# EAGLE design pam-control-module-v0 (EAGLE 8.6.3)
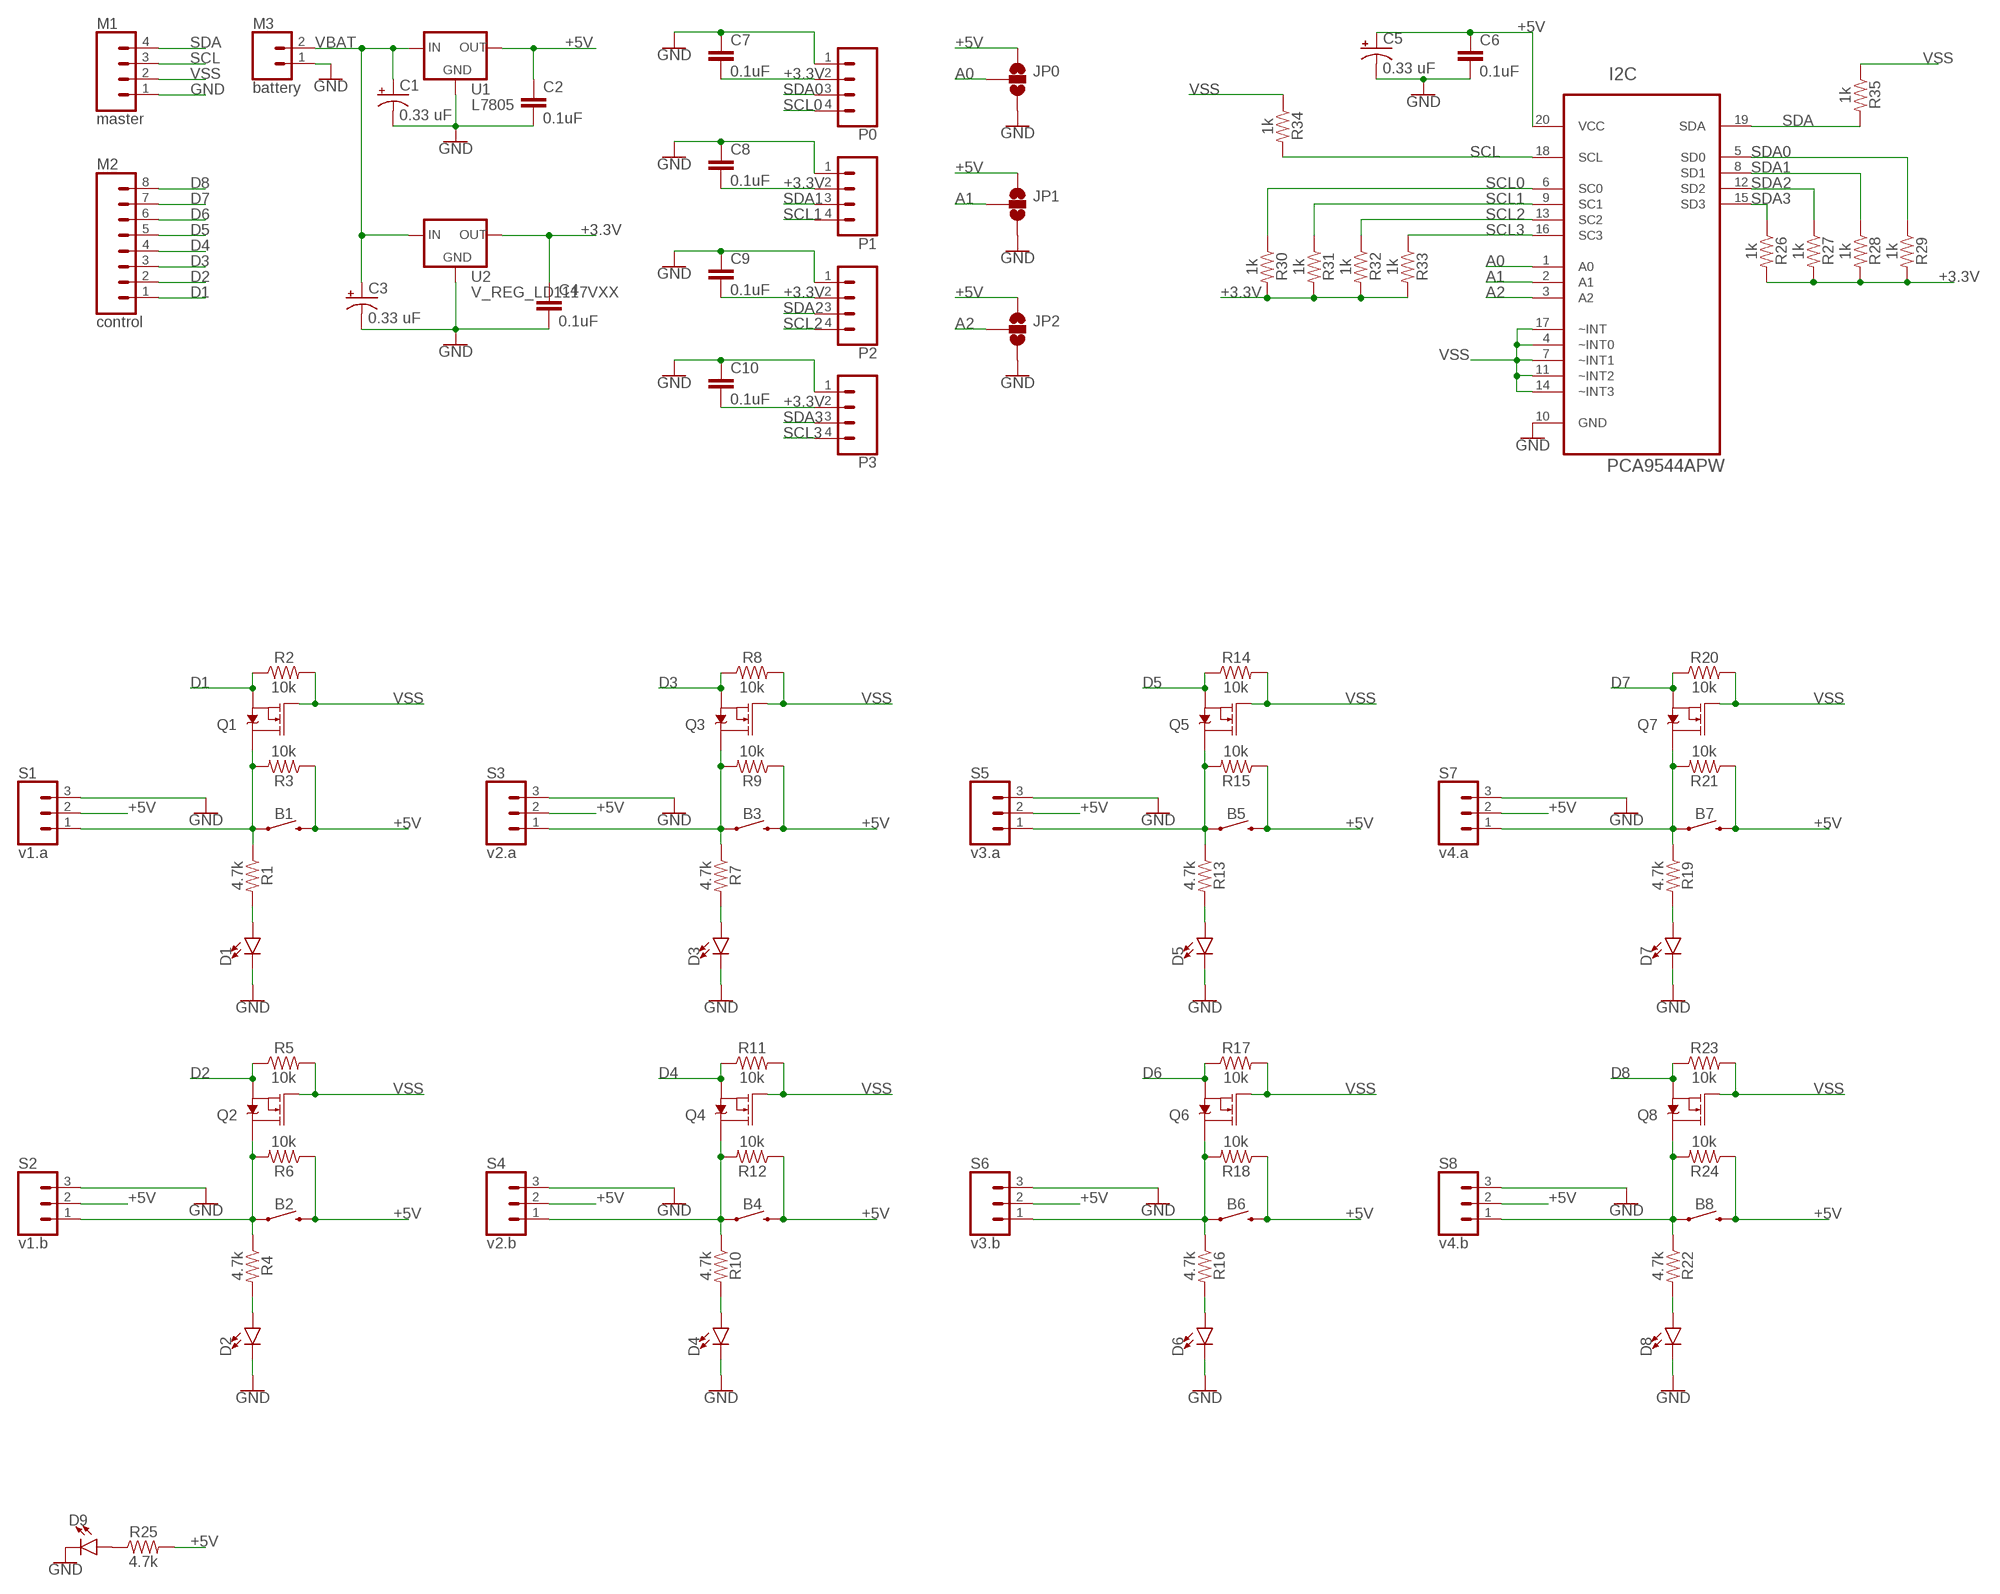
[diagram p0: schematic, sheet 1]

## Parts
B1  MOMENTARY-SWITCH-SPST-PTH-6.0MM  [TACTILE_SWITCH_PTH_6.0MM]
B2  MOMENTARY-SWITCH-SPST-PTH-6.0MM  [TACTILE_SWITCH_PTH_6.0MM]
B3  MOMENTARY-SWITCH-SPST-PTH-6.0MM  [TACTILE_SWITCH_PTH_6.0MM]
B4  MOMENTARY-SWITCH-SPST-PTH-6.0MM  [TACTILE_SWITCH_PTH_6.0MM]
B5  MOMENTARY-SWITCH-SPST-PTH-6.0MM  [TACTILE_SWITCH_PTH_6.0MM]
B6  MOMENTARY-SWITCH-SPST-PTH-6.0MM  [TACTILE_SWITCH_PTH_6.0MM]
B7  MOMENTARY-SWITCH-SPST-PTH-6.0MM  [TACTILE_SWITCH_PTH_6.0MM]
B8  MOMENTARY-SWITCH-SPST-PTH-6.0MM  [TACTILE_SWITCH_PTH_6.0MM]
C1  0.33 uF  CPOL-USE2-5  [E2-5]
C2  0.1uF  0.1UF-KIT-EZ-50V-20%  [CAP-PTH-SMALL-KIT]
C3  0.33 uF  CPOL-USE2-5  [E2-5]
C4  0.1uF  0.1UF-KIT-EZ-50V-20%  [CAP-PTH-SMALL-KIT]
C5  0.33 uF  CPOL-USE2-5  [E2-5]
C6  0.1uF  0.1UF-KIT-EZ-50V-20%  [CAP-PTH-SMALL-KIT]
C7  0.1uF  0.1UF-KIT-EZ-50V-20%  [CAP-PTH-SMALL-KIT]
C8  0.1uF  0.1UF-KIT-EZ-50V-20%  [CAP-PTH-SMALL-KIT]
C9  0.1uF  0.1UF-KIT-EZ-50V-20%  [CAP-PTH-SMALL-KIT]
C10  0.1uF  0.1UF-KIT-EZ-50V-20%  [CAP-PTH-SMALL-KIT]
D1  LED3MM  [LED_3MM]
D2  LED3MM  [LED_3MM]
D3  LED3MM  [LED_3MM]
D4  LED3MM  [LED_3MM]
D5  LED3MM  [LED_3MM]
D6  LED3MM  [LED_3MM]
D7  LED3MM  [LED_3MM]
D8  LED3MM  [LED_3MM]
D9  LED3MM  [LED_3MM]
I2C  PCA9544APW  [SOP65P640X120-20N]
JP0  JUMPER-SMT_3_NO_SILK  [SMT-JUMPER_3_NO_SILK]
JP1  JUMPER-SMT_3_NO_SILK  [SMT-JUMPER_3_NO_SILK]
JP2  JUMPER-SMT_3_NO_SILK  [SMT-JUMPER_3_NO_SILK]
M1  master  CONN_04  [1X04]
M2  control  CONN_08"  [1X08]
M3  battery  CONN_02  [1X02]
P0  CONN_04  [1X04]
P1  CONN_04  [1X04]
P2  CONN_04  [1X04]
P3  CONN_04  [1X04]
Q1  MOSFET-NCH-BSS138  [SOT23-3]
Q2  MOSFET-NCH-BSS138  [SOT23-3]
Q3  MOSFET-NCH-BSS138  [SOT23-3]
Q4  MOSFET-NCH-BSS138  [SOT23-3]
Q5  MOSFET-NCH-BSS138  [SOT23-3]
Q6  MOSFET-NCH-BSS138  [SOT23-3]
Q7  MOSFET-NCH-BSS138  [SOT23-3]
Q8  MOSFET-NCH-BSS138  [SOT23-3]
R1  4.7k  1KOHM-HORIZ-1/4W-1%  [AXIAL-0.3]
R2  10k  1KOHM-HORIZ-1/4W-1%  [AXIAL-0.3]
R3  10k  1KOHM-HORIZ-1/4W-1%  [AXIAL-0.3]
R4  4.7k  1KOHM-HORIZ-1/4W-1%  [AXIAL-0.3]
R5  10k  1KOHM-HORIZ-1/4W-1%  [AXIAL-0.3]
R6  10k  1KOHM-HORIZ-1/4W-1%  [AXIAL-0.3]
R7  4.7k  1KOHM-HORIZ-1/4W-1%  [AXIAL-0.3]
R8  10k  1KOHM-HORIZ-1/4W-1%  [AXIAL-0.3]
R9  10k  1KOHM-HORIZ-1/4W-1%  [AXIAL-0.3]
R10  4.7k  1KOHM-HORIZ-1/4W-1%  [AXIAL-0.3]
R11  10k  1KOHM-HORIZ-1/4W-1%  [AXIAL-0.3]
R12  10k  1KOHM-HORIZ-1/4W-1%  [AXIAL-0.3]
R13  4.7k  1KOHM-HORIZ-1/4W-1%  [AXIAL-0.3]
R14  10k  1KOHM-HORIZ-1/4W-1%  [AXIAL-0.3]
R15  10k  1KOHM-HORIZ-1/4W-1%  [AXIAL-0.3]
R16  4.7k  1KOHM-HORIZ-1/4W-1%  [AXIAL-0.3]
R17  10k  1KOHM-HORIZ-1/4W-1%  [AXIAL-0.3]
R18  10k  1KOHM-HORIZ-1/4W-1%  [AXIAL-0.3]
R19  4.7k  1KOHM-HORIZ-1/4W-1%  [AXIAL-0.3]
R20  10k  1KOHM-HORIZ-1/4W-1%  [AXIAL-0.3]
R21  10k  1KOHM-HORIZ-1/4W-1%  [AXIAL-0.3]
R22  4.7k  1KOHM-HORIZ-1/4W-1%  [AXIAL-0.3]
R23  10k  1KOHM-HORIZ-1/4W-1%  [AXIAL-0.3]
R24  10k  1KOHM-HORIZ-1/4W-1%  [AXIAL-0.3]
R25  4.7k  1KOHM-HORIZ-1/4W-1%  [AXIAL-0.3]
R26  1k  1KOHM-HORIZ-1/4W-1%  [AXIAL-0.3]
R27  1k  1KOHM-HORIZ-1/4W-1%  [AXIAL-0.3]
R28  1k  1KOHM-HORIZ-1/4W-1%  [AXIAL-0.3]
R29  1k  1KOHM-HORIZ-1/4W-1%  [AXIAL-0.3]
R30  1k  1KOHM-HORIZ-1/4W-1%  [AXIAL-0.3]
R31  1k  1KOHM-HORIZ-1/4W-1%  [AXIAL-0.3]
R32  1k  1KOHM-HORIZ-1/4W-1%  [AXIAL-0.3]
R33  1k  1KOHM-HORIZ-1/4W-1%  [AXIAL-0.3]
R34  1k  1KOHM-HORIZ-1/4W-1%  [AXIAL-0.3]
R35  1k  1KOHM-HORIZ-1/4W-1%  [AXIAL-0.3]
S1  v1.a  CONN_03  [1X03]
S2  v1.b  CONN_03  [1X03]
S3  v2.a  CONN_03  [1X03]
S4  v2.b  CONN_03  [1X03]
S5  v3.a  CONN_03  [1X03]
S6  v3.b  CONN_03  [1X03]
S7  v4.a  CONN_03  [1X03]
S8  v4.b  CONN_03  [1X03]
U1  L7805  V_REG_78XXSIDE  [78XXL]
U2  V_REG_LD1117VXX  [78XXL]

## Nets
+3.3V: C4.1 C7.2 C8.2 C9.2 C10.2 P0.2 P1.2 P2.2 P3.2 R26.P$2 R27.P$2 R28.P$2 R29.P$2 R30.P$2 R31.P$2 R32.P$2 R33.P$2 U2.GND(OUT)
+5V: B1.3 B2.3 B3.3 B4.3 B5.3 B6.3 B7.3 B8.3 C2.1 C5.+ C6.1 I2C.20(VCC) JP0.1 JP1.1 JP2.1 R3.P$1 R6.P$1 R9.P$1 R12.P$1 R15.P$1 R18.P$1 R21.P$1 R24.P$1 R25.P$2 S1.2 S2.2 S3.2 S4.2 S5.2 S6.2 S7.2 S8.2 U1.OUT
A0: I2C.1(A0) JP0.2
A1: I2C.2(A1) JP1.2
A2: I2C.3(A2) JP2.2
D1: M2.1 Q1.2(S) R2.P$1
D2: M2.2 Q2.2(S) R5.P$1
D3: M2.3 Q3.2(S) R8.P$1
D4: M2.4 Q4.2(S) R11.P$1
D5: M2.5 Q5.2(S) R14.P$1
D6: M2.6 Q6.2(S) R17.P$1
D7: M2.7 Q7.2(S) R20.P$1
D8: M2.8 Q8.2(S) R23.P$1
GND: C1.- C2.2 C3.- C4.2 C5.- C6.2 C7.1 C8.1 C9.1 C10.1 D1.K(C) D2.K(C) D3.K(C) D4.K(C) D5.K(C) D6.K(C) D7.K(C) D8.K(C) D9.K(C) I2C.10(GND) JP0.3 JP1.3 JP2.3 M1.1 M3.1 P0.1 P1.1 P2.1 P3.1 S1.3 S2.3 S3.3 S4.3 S5.3 S6.3 S7.3 S8.3 U1.GND U2.IN(GND)
N$1: D1.A R1.P$2
N$2: D2.A R4.P$2
N$3: D3.A R7.P$2
N$4: D4.A R10.P$2
N$5: B2.1 Q2.3(D) R4.P$1 R6.P$2 S2.1
N$6: D5.A R13.P$2
N$7: D6.A R16.P$2
N$8: D7.A R19.P$2
N$9: D8.A R22.P$2
N$10: D9.A R25.P$1
N$11: B4.1 Q4.3(D) R10.P$1 R12.P$2 S4.1
N$12: B6.1 Q6.3(D) R16.P$1 R18.P$2 S6.1
N$13: B8.1 Q8.3(D) R22.P$1 R24.P$2 S8.1
N$14: B7.1 Q7.3(D) R19.P$1 R21.P$2 S7.1
N$15: B5.1 Q5.3(D) R13.P$1 R15.P$2 S5.1
N$16: B3.1 Q3.3(D) R7.P$1 R9.P$2 S3.1
N$17: B1.1 Q1.3(D) R1.P$1 R3.P$2 S1.1
SCL: I2C.18(SCL) M1.3 R34.P$2
SCL0: I2C.6(SC0) P0.4 R30.P$1
SCL1: I2C.9(SC1) P1.4 R31.P$1
SCL2: I2C.13(SC2) P2.4 R32.P$1
SCL3: I2C.16(SC3) P3.4 R33.P$1
SDA: I2C.19(SDA) M1.4 R35.P$2
SDA0: I2C.5(SD0) P0.3 R29.P$1
SDA1: I2C.8(SD1) P1.3 R28.P$1
SDA2: I2C.12(SD2) P2.3 R27.P$1
SDA3: I2C.15(SD3) P3.3 R26.P$1
VBAT: C1.+ C3.+ M3.2 U1.IN U2.OUT(IN)
VSS: I2C.4(~INT0) I2C.7(~INT1) I2C.11(~INT2) I2C.14(~INT3) I2C.17(~INT) M1.2 Q1.1(G) Q2.1(G) Q3.1(G) Q4.1(G) Q5.1(G) Q6.1(G) Q7.1(G) Q8.1(G) R2.P$2 R5.P$2 R8.P$2 R11.P$2 R14.P$2 R17.P$2 R20.P$2 R23.P$2 R34.P$1 R35.P$1

## Library data of the parts
B1-B8 = SparkFun-Switches:MOMENTARY-SWITCH-SPST: Momentary Switch (Pushbutton) - SPST Normally-open (NO) SPST momentary switches (buttons, pushbuttons). Variants PTH-12MM - 12mm square, through-hole Momentary Pushbutton Switch - 12mm Square <https://www.sparkfun.com/products/9190> (COM-09190) PTH-6.0MM, PTH-6.0MM-KIT - 6.0mm square, through-hole Mini Pushbutton Switch <https://www.sparkfun.com/products/97> (COM-00097) KIT package intended for soldering kit's - only one side of pads' copper is exposed. PTH-RIGHT-ANGLE-KIT - Right-angle, through-hole Right Angle Tactile Button <https://www.sparkfun.com/products/10791> - Used on SparkFun BigTime Watch Kit <https://www.sparkfun.com/products/11734> SMD-12MM - 12mm square, surface-mount Tactile Button - SMD (12mm) <https://www.sparkfun.com/products/12993> (COM-12993) Used on SparkFun PicoBoard <https://www.sparkfun.com/products/11888> SMD-4.5MM - 4.5mm Square Trackball Switch Used on SparkFun Blackberry Trackballer Breakout <https://www.sparkfun.com/products/13169> SMD-4.6MMX2.8MM - 4.60mm x 2.80mm, surface mount Used on SparkFun SAMD21 Mini Breakout <https://www.sparkfun.com/products/13664> SMD-5.2MM, SMD-5.2-REDUNDANT - 5.2mm square, surface-mount Mini Pushbutton Switch - SMD <https://www.sparkfun.com/products/8720> (COM-08720) Used on Arduino Pro Mini <https://www.sparkfun.com/products/11114> REDUNDANT package connects both switch circuits together SMD-6.0X3.5MM - 6.0 x 3.5mm, surface mount Momentary Reset Switch SMD <https://www.sparkfun.com/products/8229> (COM-08229) SMD-6.2MM-TALL - 6.2mm square, surface mount Tactile Button - SMD (6mm) <https://www.sparkfun.com/products/12992> Used on SparkFun Digital Sandbox <https://www.sparkfun.com/products/12651> SMD-RIGHT-ANGLE - Right-angle, surface mount Used on SparkFun Block for Intel® Edison - Arduino <https://www.sparkfun.com/products/13036>; PROD_ID: SWCH-08441; SF_SKU: COM-00097
C1 C3 C5 = adafruit:CPOL-US: POLARIZED CAPACITOR, American symbol
C2 C4 C6-C10 = SparkFun-Capacitors:0.1UF: 0.1µF ceramic capacitors A capacitor is a passive two-terminal electrical component used to store electrical energy temporarily in an electric field.; PROD_ID: CAP-08370
D1-D9 = SparkFun-LED:LED: LED (Generic) Standard schematic elements and footprints for 5mm, 3mm, 1206, and 0603 sized LEDs. Generic LEDs with no color specified.; PROD_ID: DIO-08794
I2C = PCA9544APW:PCA9544APW: 4-CHANNEL I2C AND SMBus MULTIPLEXER WITH INTERRUPT LOGIC; AVAILABILITY: Unavailable; DESCRIPTION: 4-Channel I2C And SMBus Multiplexer With Interrupt Logic 20-TSSOP -40 to 85; MF: Texas Instruments; MP: PCA9544APW; PACKAGE: TSSOP-20 Texas Instruments; PRICE: None
JP0 JP1 JP2 = SparkFun-Jumpers:JUMPER-SMT_3_NO: Normally open jumper This jumper has three pads in close proximity to each other. Apply solder to close the connection(s).
M1 P0 P1-P3 = SparkFun-Connectors:CONN_04: Multi connection point. Often used as Generic Header-pin footprint for 0.1 inch spaced/style header connections On any of the 0.1 inch spaced packages, you can populate with these: Break Away Headers - Straight <https://www.sparkfun.com/products/116> (PRT-00116) Break Away Male Headers - Right Angle <https://www.sparkfun.com/products/553> (PRT-00553) Female Headers <https://www.sparkfun.com/products/115> (PRT-00115) Break Away Headers - Machine Pin <https://www.sparkfun.com/products/117> (PRT-00117) Break Away Female Headers - Swiss Machine Pin <https://www.sparkfun.com/products/743> (PRT-00743) For SCREWTERMINALS and SPRING TERMINALS visit here: Screw Terimnals on SparkFun.com <https://www.sparkfun.com/search/results?term=Screw+Terminals> (5mm/3.5mm/2.54mm spacing) This device is also useful as a general connection point to wire up your design to another part of your project. Our various solder wires solder well into these plated through hole pads. Hook-Up Wire - Assortment (Stranded, 22 AWG) <https://www.sparkfun.com/products/11375> (PRT-11375) Hook-Up Wire - Assortment (Solid Core, 22 AWG) <https://www.sparkfun.com/products/11367> (PRT-11367) View the entire wire category on our website here <https://www.sparkfun.com/categories/141> Special notes: Molex polarized connector foot print use with SKU : PRT-08231 with associated crimp pins and housings. 1MM SMD Version SKU: PRT-10208; PROD_ID: CONN-09696
M2 = SparkFun-Connectors:CONN_08: Multi connection point. Often used as Generic Header-pin footprint for 0.1 inch spaced/style header connections On any of the 0.1 inch spaced packages, you can populate with these: Break Away Headers - Straight <https://www.sparkfun.com/products/116> (PRT-00116) Break Away Male Headers - Right Angle <https://www.sparkfun.com/products/553> (PRT-00553) Female Headers <https://www.sparkfun.com/products/115> (PRT-00115) Break Away Headers - Machine Pin <https://www.sparkfun.com/products/117> (PRT-00117) Break Away Female Headers - Swiss Machine Pin <https://www.sparkfun.com/products/743> (PRT-00743) Arduino Stackable Header - 8 Pin <https://www.sparkfun.com/products/9279> (PRT-09279) For SCREWTERMINALS and SPRING TERMINALS visit here: Screw Terimnals on SparkFun.com <https://www.sparkfun.com/search/results?term=Screw+Terminals> (5mm/3.5mm/2.54mm spacing) This device is also useful as a general connection point to wire up your design to another part of your project. Our various solder wires solder well into these plated through hole pads. Hook-Up Wire - Assortment (Stranded, 22 AWG) <https://www.sparkfun.com/products/11375> (PRT-11375) Hook-Up Wire - Assortment (Solid Core, 22 AWG) <https://www.sparkfun.com/products/11367> (PRT-11367) View the entire wire category on our website here <https://www.sparkfun.com/categories/141> Special notes: Molex polarized connector foot print use with SKU : PRT-08231 with associated crimp pins and housings. 1MM SMD Version SKU: PRT-10208 NOTES ON THE VARIANTS LOCK and LOCK_LONGPADS... This footprint was designed to help hold the alignment of a through-hole component (i.e. 6-pin header) while soldering it into place. You may notice that each hole has been shifted either up or down by 0.005 of an inch from it's more standard position (which is a perfectly straight line). This slight alteration caused the pins (the squares in the middle) to touch the edges of the holes. Because they are alternating, it causes a "brace" to hold the component in place. 0.005 has proven to be the perfect amount of "off-center" position when using our standard breakaway headers. Although looks a little odd when you look at the bare footprint, once you have a header in there, the alteration is very hard to notice. Also,if you push a header all the way into place, it is covered up entirely on the bottom side.; PROD_ID: CONN-08438
M3 = SparkFun-Connectors:CONN_02: Multi connection point. Often used as Generic Header-pin footprint for 0.1 inch spaced/style header connections On any of the 0.1 inch spaced packages, you can populate with these: Break Away Headers - Straight <https://www.sparkfun.com/products/116> (PRT-00116) Break Away Male Headers - Right Angle <https://www.sparkfun.com/products/553> (PRT-00553) Female Headers <https://www.sparkfun.com/products/115> (PRT-00115) Break Away Headers - Machine Pin <https://www.sparkfun.com/products/117> (PRT-00117) Break Away Female Headers - Swiss Machine Pin <https://www.sparkfun.com/products/743> (PRT-00743) For SCREWTERMINALS and SPRING TERMINALS visit here: Screw Terimnals on SparkFun.com <https://www.sparkfun.com/search/results?term=Screw+Terminals> (5mm/3.5mm/2.54mm spacing) This device is also useful as a general connection point to wire up your design to another part of your project. Our various solder wires solder well into these plated through hole pads. Hook-Up Wire - Assortment (Stranded, 22 AWG) <https://www.sparkfun.com/products/11375> (PRT-11375) Hook-Up Wire - Assortment (Solid Core, 22 AWG) <https://www.sparkfun.com/products/11367> (PRT-11367) View the entire wire category on our website here <https://www.sparkfun.com/categories/141> Special notes: Molex polarized connector foot print use with: PRT-08233 with associated crimp pins and housings. 2.54_SCREWTERM for use with PRT-10571. 3.5mm Screw Terminal footprints for PRT-08084 5mm Screw Terminal footprints for use with PRT-08432
Q1-Q8 = SparkFun-DiscreteSemi:MOSFET-NCH: N-channel MOSFETs Voltage controlled devices that allow control of high current outputs. SparkFun Products: SparkFun OpenScale <https://www.sparkfun.com/products/13261> SparkFun Digital Sandbox <https://www.sparkfun.com/products/12651> SparkFun Monster Moto Shield <https://www.sparkfun.com/products/10182> SparkFun MOSFET Power Controller <https://www.sparkfun.com/products/11214>; PROD_ID: TRANS-00830; VALUE: 220mA/50V/3.5Ω
R1-R25 = SparkFun-Resistors:1KOHM: 1kΩ resistor A resistor is a passive two-terminal electrical component that implements electrical resistance as a circuit element. Resistors act to reduce current flow, and, at the same time, act to lower voltage levels within circuits. - Wikipedia; PROD_ID: RES-12182; VALUE: 1k
R26-R35 = SparkFun-Resistors:1KOHM: 1kΩ resistor A resistor is a passive two-terminal electrical component that implements electrical resistance as a circuit element. Resistors act to reduce current flow, and, at the same time, act to lower voltage levels within circuits. - Wikipedia; PROD_ID: RES-12182
S1-S8 = SparkFun-Connectors:CONN_03: Multi connection point. Often used as Generic Header-pin footprint for 0.1 inch spaced/style header connections On any of the 0.1 inch spaced packages, you can populate with these: Break Away Headers - Straight <https://www.sparkfun.com/products/116> (PRT-00116) Break Away Male Headers - Right Angle <https://www.sparkfun.com/products/553> (PRT-00553) Female Headers <https://www.sparkfun.com/products/115> (PRT-00115) Break Away Headers - Machine Pin <https://www.sparkfun.com/products/117> (PRT-00117) Break Away Female Headers - Swiss Machine Pin <https://www.sparkfun.com/products/743> (PRT-00743) Stackable Header - 3 Pin (Female, 0.1") <https://www.sparkfun.com/products/13875> (PRT-13875) For SCREWTERMINALS and SPRING TERMINALS visit here: Screw Terimnals on SparkFun.com <https://www.sparkfun.com/search/results?term=Screw+Terminals> (5mm/3.5mm/2.54mm spacing) This device is also useful as a general connection point to wire up your design to another part of your project. Our various solder wires solder well into these plated through hole pads. Hook-Up Wire - Assortment (Stranded, 22 AWG) <https://www.sparkfun.com/products/11375> (PRT-11375) Hook-Up Wire - Assortment (Solid Core, 22 AWG) <https://www.sparkfun.com/products/11367> (PRT-11367) View the entire wire category on our website here <https://www.sparkfun.com/categories/141> Special notes: Molex polarized connector foot print use with SKU : PRT-08232 with associated crimp pins and housings.
U1 = SparkFun-IC-Power:V_REG_78XX: Voltage Regulator Standard 78xx regulator. IGO (Input Ground Output). Spark Fun Electronics SKU : COM-00107
U2 = SparkFun-IC-Power:V_REG_LD1117VXX: LD1117VXX voltage regulator. We carry the 3.3V version (COM-00526) in TO-220 package.

## Board
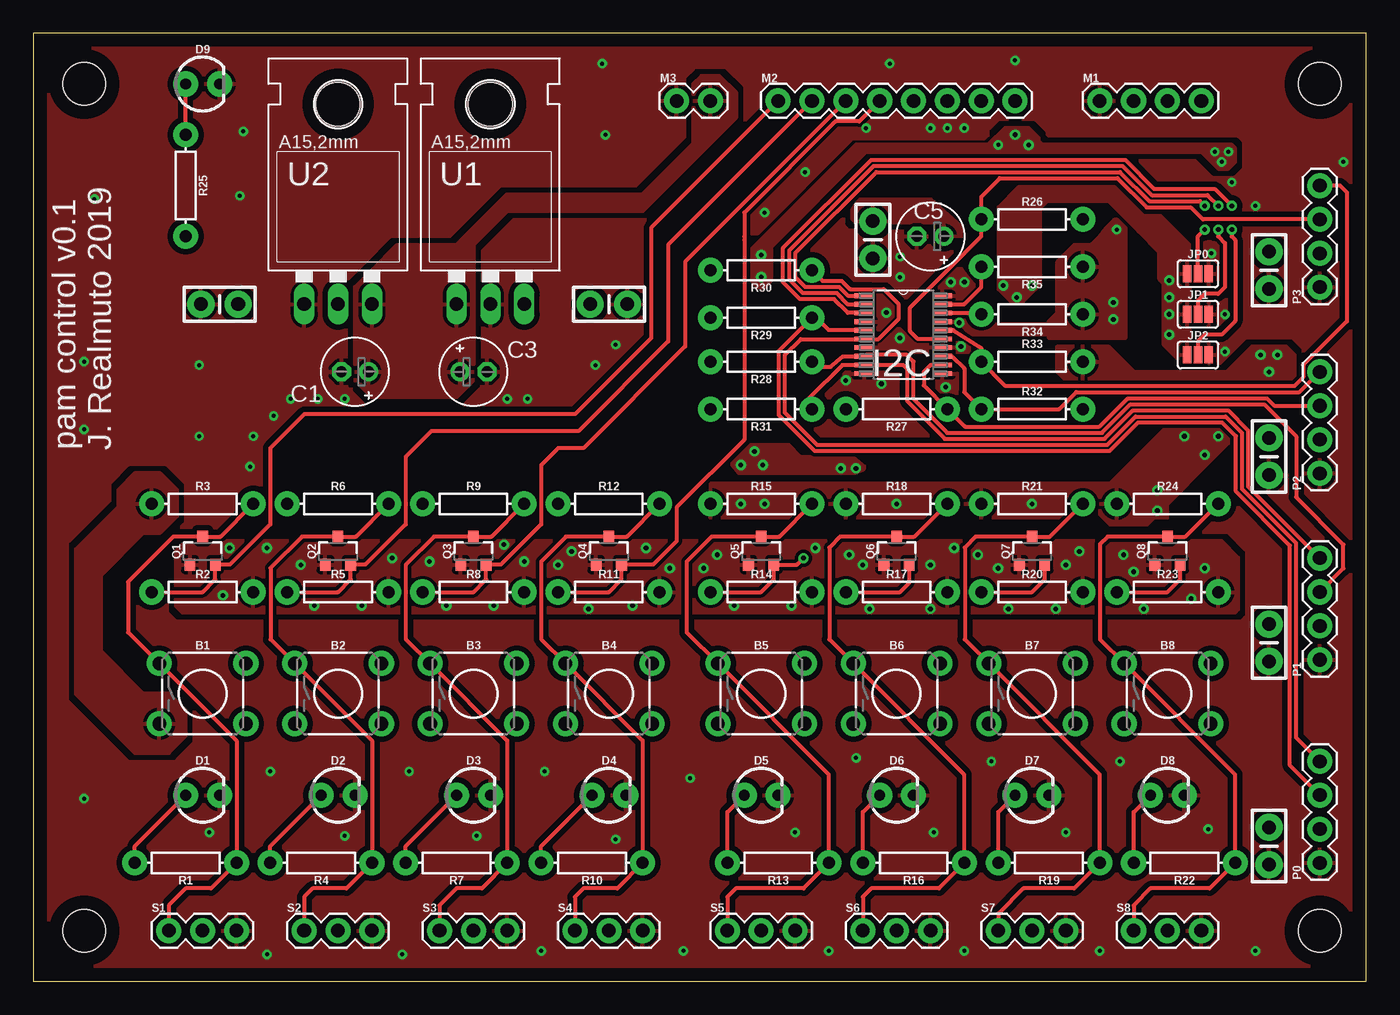
[diagram p1: board, top side]
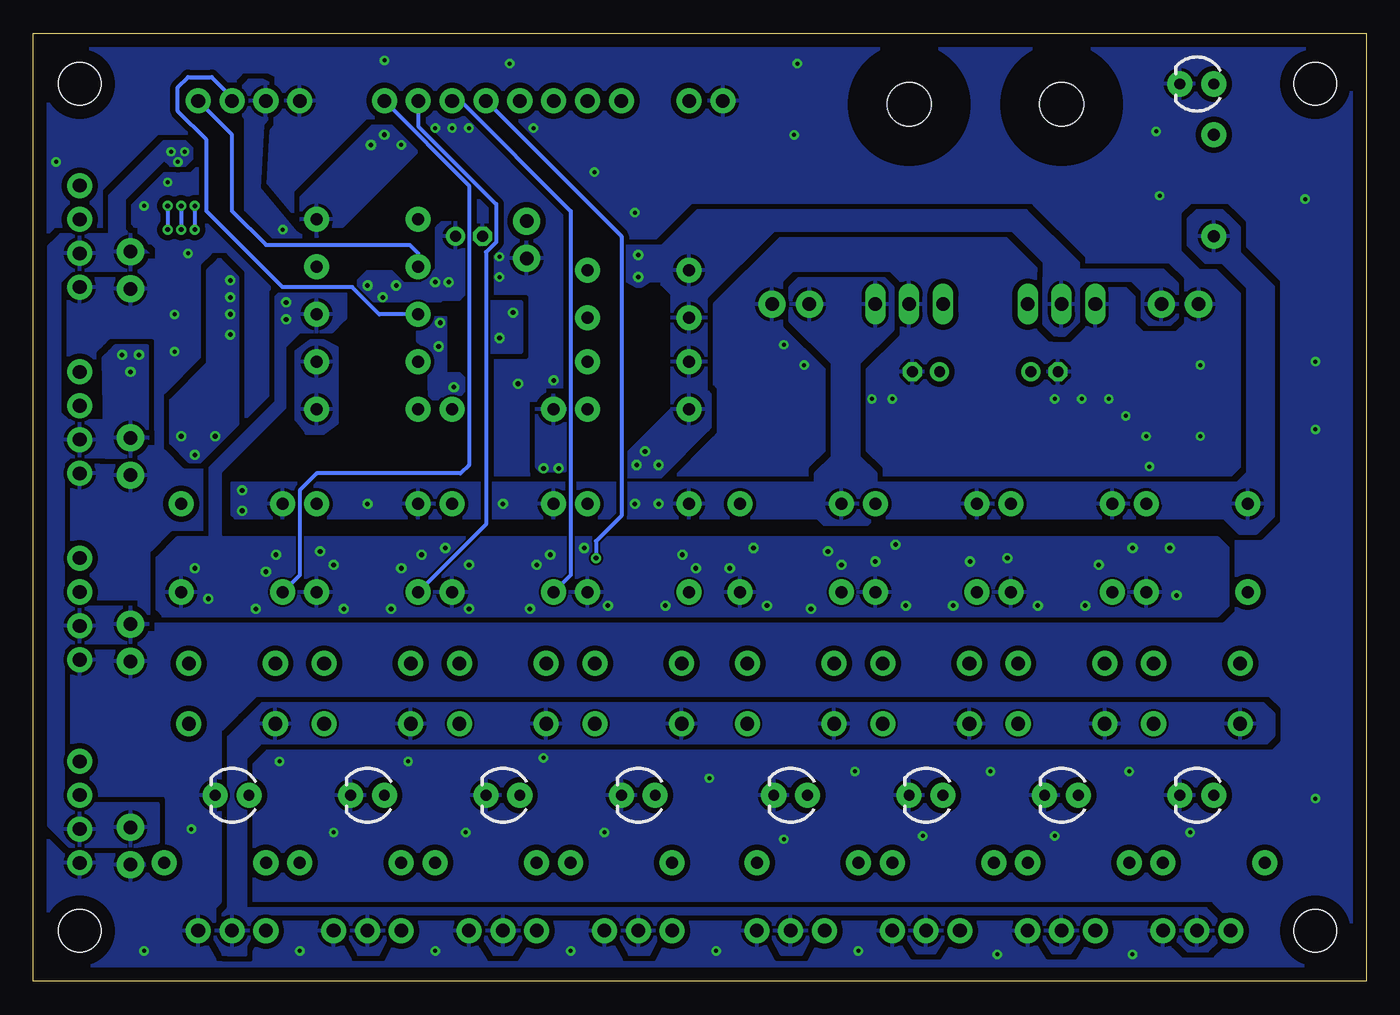
[diagram p2: board, bottom side, seen from below]

Size 100 x 71.11 mm. Coordinates in mm from the lower left corner, seen from the top.
Outline: 0,0 100,0 100,71.11 0,71.11 0,0
Copper layers (1*16): Top 0.035mm / dielectric 1.5mm / Bottom 0.035mm
Design rules "default *": minimum track width 6mil, minimum drill 0.3mm, track to track 6mil, track to pad 6mil, pad to pad 6mil, via to via 6mil, smd to smd 6mil, copper to edge 40mil, drill to drill 6mil, minimum pad ring 10mil, minimum via ring 8mil, stop-mask expansion 4mil, vias tented up to drill 0mil, thermal gap 10mil
Holes 3.2 mm at 3.81,3.81 3.81,67.31 96.52,3.81 96.52,67.31

### Footprints (pad centres in the part's own frame; a part is rotated, then mirrored left to right if it is on the bottom)
TACTILE_SWITCH_PTH_6.0MM = drill 1.016 pad 1.88: 1 -3.251,2.261; 2 3.251,2.261; 3 -3.251,-2.261; 4 3.251,-2.261
E2-5 = drill 0.813 pad 1.422: + -1.016,0 | drill 0.813 pad 1.422 octagon: - 1.016,0
CAP-PTH-SMALL-KIT = drill 1.016 pad 2.032: 1 -1.397,0; 2 1.397,0
LED_3MM = drill 0.813 pad 1.88: A -1.27,0; K 1.27,0
SOP65P640X120-20N = smd 1.473 x 0.356: 1 -2.921,2.921; 2 -2.921,2.286; 3 -2.921,1.626; 4 -2.921,0.965; 5 -2.921,0.33; 6 -2.921,-0.33; 7 -2.921,-0.965; 8 -2.921,-1.626; 9 -2.921,-2.286; 10 -2.921,-2.921; 11 2.921,-2.921; 12 2.921,-2.286; 13 2.921,-1.626; 14 2.921,-0.965; 15 2.921,-0.33; 16 2.921,0.33; 17 2.921,0.965; 18 2.921,1.626; 19 2.921,2.286; 20 2.921,2.921
SMT-JUMPER_3_NO_SILK = smd 0.635 x 1.27: 1 -0.813,0; 2 0,0; 3 0.813,0
1X04 = drill 1.016 pad 1.88: 1 0,0; 2 2.54,0; 3 5.08,0; 4 7.62,0
1X08 = drill 1.016 pad 1.88: 1 0,0; 2 2.54,0; 3 5.08,0; 4 7.62,0; 5 10.16,0; 6 12.7,0; 7 15.24,0; 8 17.78,0
1X02 = drill 1.016 pad 1.88: 1 0,0; 2 2.54,0
SOT23-3 = smd 0.8 x 0.9: 1 -0.95,-1; 2 0.95,-1; 3 0,1.1
AXIAL-0.3 = drill 0.9 pad 1.88: P$1 -3.81,0; P$2 3.81,0
1X03 = drill 1.016 pad 1.88: 1 0,0; 2 2.54,0; 3 5.08,0
78XXL = drill 1.016 long: GND 0,-3.81; IN -2.54,-3.81; OUT 2.54,-3.81 | hole 3.302: 0,11.176

### Placement (x,y rotation side)
B1  12.7,21.59 0 top
B2  22.86,21.59 0 top
B3  33.02,21.59 0 top
B4  43.18,21.59 0 top
B5  54.61,21.59 0 top
B6  64.77,21.59 0 top
B7  74.93,21.59 0 top
B8  85.09,21.59 0 top
C1  24.13,45.72 180 top
C2  43.18,50.8 0 top
C3  33.02,45.72 0 top
C4  13.97,50.8 180 top
C5  67.31,55.88 180 top
C6  62.99,55.63 270 top
C7  92.71,10.16 90 top
C8  92.71,25.4 90 top
C9  92.71,39.37 90 top
C10  92.71,53.34 90 top
D1  12.7,13.97 0 top
D2  22.86,13.97 0 top
D3  33.02,13.97 0 top
D4  43.18,13.97 0 top
D5  54.61,13.97 0 top
D6  64.77,13.97 0 top
D7  74.93,13.97 0 top
D8  85.09,13.97 0 top
D9  12.7,67.31 0 top
I2C  65.28,48.51 0 top
JP0  87.38,53.09 0 top
JP1  87.38,50.04 0 top
JP2  87.38,46.99 0 top
M1  80.01,66.04 0 top
M2  55.88,66.04 0 top
M3  48.26,66.04 0 top
P0  96.52,8.89 90 top
P1  96.52,24.13 90 top
P2  96.52,38.1 90 top
P3  96.52,52.07 90 top
Q1  12.7,32.26 0 top
Q2  22.86,32.26 0 top
Q3  33.02,32.26 0 top
Q4  43.18,32.26 0 top
Q5  54.61,32.26 0 top
Q6  64.77,32.26 0 top
Q7  74.93,32.26 0 top
Q8  85.09,32.26 0 top
R1  11.43,8.89 180 top
R2  12.7,29.21 0 top
R3  12.7,35.81 0 top
R4  21.59,8.89 180 top
R5  22.86,29.21 0 top
R6  22.86,35.81 0 top
R7  31.75,8.89 180 top
R8  33.02,29.21 0 top
R9  33.02,35.81 0 top
R10  41.91,8.89 180 top
R11  43.18,29.21 0 top
R12  43.18,35.81 0 top
R13  55.88,8.89 180 top
R14  54.61,29.21 0 top
R15  54.61,35.81 0 top
R16  66.04,8.89 180 top
R17  64.77,29.21 0 top
R18  64.77,35.81 0 top
R19  76.2,8.89 180 top
R20  74.93,29.21 0 top
R21  74.93,35.81 0 top
R22  86.36,8.89 180 top
R23  85.09,29.21 0 top
R24  85.09,35.81 0 top
R25  11.43,59.69 270 top
R26  74.93,57.15 0 top
R27  64.77,42.93 180 top
R28  54.61,46.48 180 top
R29  54.61,49.78 180 top
R30  54.61,53.34 180 top
R31  54.61,42.93 180 top
R32  74.93,42.93 0 top
R33  74.93,46.48 0 top
R34  74.93,50.04 180 top
R35  74.93,53.59 180 top
S1  10.16,3.81 0 top
S2  20.32,3.81 0 top
S3  30.48,3.81 0 top
S4  40.64,3.81 0 top
S5  52.07,3.81 0 top
S6  62.23,3.81 0 top
S7  72.39,3.81 0 top
S8  82.55,3.81 0 top
U1  34.29,54.61 0 top
U2  22.86,54.61 0 top

### Tracks (layer width: path | path; a pad name or v marks a point on that pad's centre or on a via)
+3.3V  (via drill 0.3, 0.35)
  other vias: 60.58,38.48 61.72,38.48 53.09,38.73 54.74,38.73 54.1,39.75 73.66,63.5 72.39,62.74 74.68,62.74 54.61,54.48 54.61,52.83 92.08,46.99 93.34,46.99 92.71,45.72 88.65,62.23 89.66,62.23 89.15,61.47
  pour Bottom: 21.84,49.28 22.61,48.51 23.37,48.51 24.13,49.28 24.13,52.83 23.62,53.34 15.24,53.34 14.22,52.32 14.22,49.78 14.73,49.28 16.26,49.28 16.76,49.78 16.76,51.82 17.53,52.58 21.08,52.58 21.84,51.82
  pour Bottom (isolate 0.254): 78.23,48.01 79.25,48.01 80.26,47.24 80.26,42.16 79.5,41.15 78.23,41.15 77.22,41.91 77.22,47.5
  pour Bottom (isolate 0.254): 49.53,53.34 49.53,53.98 50.29,54.74 51.44,54.74 52.07,54.1 52.07,53.21 52.07,41.78 51.69,41.4 50.16,41.4 49.53,42.04
  pour Bottom (isolate 0.254): 92.46,56.01 92.46,54.23 92.58,53.34 97.16,53.34 98.04,52.45 98.04,42.67 97.41,42.04 92.33,42.04 91.44,41.15 91.44,39.75 91.82,39.37 97.28,39.37 97.79,38.86 97.79,28.58 97.28,28.07 92.2,28.07 91.44,27.3 91.44,26.03 92.08,25.4 97.28,25.4 97.79,24.89 97.79,13.34 90.68,13.34 90.68,10.41 92.2,10.16 97.28,10.16 99.06,11.94 99.06,54.86 97.92,56.01
  pour Bottom (isolate 0.254): 93.98,39.37 91.44,39.37 91.44,47.62 93.85,47.62 94.23,47.24 94.74,46.74 94.61,39.37
  pour Bottom: 60.33,43.94 61.59,43.94 62.23,43.31 62.23,38.61 61.98,38.35 60.07,38.35 60.07,43.69
  pour Top (isolate 0.254): 52.45,38.86 53.85,40.26 56.64,40.26 57.53,39.37 61.47,39.37 62.36,38.61 62.23,38.35 61.59,38.1 52.96,38.1 52.45,38.73
  pour Bottom (isolate 0.254): 49.28,43.56 49.28,41.53 49.4,41.4 52.96,37.85 55.37,37.85 55.37,39.62 50.8,44.2 49.4,44.2 49.28,44.07
  pour Bottom (isolate 0.254): 21.59,49.53 21.59,53.85 21.72,53.98 25.53,57.78 50.16,57.78 52.83,55.12 52.83,52.32 51.82,51.31 51.05,51.31 49.53,51.31 44.45,56.39 26.54,56.39 24.13,53.98 24.13,49.66 23.11,48.64 23.11,48.51 22.61,48.51
  pour Bottom (isolate 0.254): 77.47,56.64 78.11,56.01 78.11,55.88 78.99,55.88 79.88,56.77 79.88,57.4 79.88,58.8 74.55,64.14 73.28,64.14 73.15,64.14 71.25,62.23 76.83,56.64
  pour Bottom: 49.53,54.1 50.29,55.12 55.5,55.12 55.5,52.58 54.74,52.2 54.36,52.2 53.72,52.58 50.16,52.58 49.53,53.21
  pour Top (isolate 0.254): 76.83,47.62 80.64,47.62 82.55,45.72 89.53,45.72 91.44,47.62 93.98,47.62 94.61,46.99 94.61,45.09 77.47,45.09 76.83,45.72
  pour Top (isolate 0.254): 53.85,54.86 53.85,52.58 54.36,52.07 54.61,52.07 54.86,52.07 55.37,52.58 55.37,55.12 62.48,62.23 75.18,62.23 75.44,62.48 75.44,63.25 74.68,64.01 73.15,64.01 72.9,64.01 71.63,62.74 61.72,62.74
  pour Bottom (isolate 0.254): 92.71,53.34 93.47,53.34 94.23,54.1 94.23,58.93 93.22,59.94 90.17,62.99 88.9,62.99 88.65,62.99 88.14,62.48 88.14,61.72 88.65,61.21 89.41,61.21 89.66,61.21 90.17,61.72 93.22,58.67 93.22,56.39 91.19,54.36 91.19,53.85 91.69,53.34
  pour Top (isolate 0.254): 89.15,60.96 89.66,60.96 90.17,61.47 90.17,62.48 89.92,62.74 88.14,62.74 75.69,62.74 74.42,64.01 73.91,64.01 73.15,64.01 72.9,64.01 71.63,62.74 71.63,62.48 71.88,62.23 87.63,62.23 88.65,61.21 88.9,60.96
+5V  (via drill 0.35)
  other vias: 53.09,35.81 54.86,35.81 64.77,35.81 74.93,35.81 84.33,35.31 84.33,36.83 85.22,52.58 85.22,51.31 85.22,50.04 85.22,48.51 86.36,40.89 88.9,40.89 87.88,39.5 68.83,52.45 69.85,52.45 72.77,52.2 74.93,52.2 73.79,51.31
  pour Bottom (isolate 0.254): 7.62,35.56 7.62,37.08 7.87,37.34 85.09,37.34 85.09,35.05 84.84,34.8 7.87,34.8 7.62,35.05
  pour Top (isolate 0.254): 50.8,37.34 50.8,34.8 85.09,34.8 85.09,37.34
  pour Bottom (isolate 0.254): 35.81,37.34 37.59,37.08 37.85,36.83
  pour Bottom: 7.75,20.83 6.99,20.07 6.99,18.41 7.49,17.91 82.93,17.91 84.07,19.05 84.07,19.56 82.8,20.83
  pour Bottom (isolate 0.254): 12.06,5.46 11.3,4.7 11.3,2.92 11.94,2.29 13.34,2.29 14.1,3.05 14.1,4.57 14.61,5.08 21.08,5.08 21.59,4.57 21.59,3.17 22.23,2.16 23.5,2.16 24.13,3.17 24.13,4.57 24.64,5.08 31.24,5.08 31.75,4.57 31.75,3.17 32.38,2.16 33.66,2.16 34.29,3.17 34.29,4.45 34.92,5.08 41.27,5.08 41.91,4.45 41.91,3.05 42.42,2.03 43.81,2.03 44.45,3.17 44.45,4.45 45.09,5.08 52.7,5.08 53.34,4.45 53.34,3.05 53.85,2.03 55.24,2.03 55.88,3.17 55.88,4.45 56.52,5.08 62.87,5.08 63.5,4.45 63.5,3.05 64.14,2.03 65.41,2.03 66.04,3.05 66.04,4.45 66.67,5.08 73.03,5.08 73.66,4.45 73.66,3.05 74.17,2.03 75.56,2.03 76.2,3.17 76.2,4.45 76.83,5.08 83.19,5.08 83.82,4.45 83.82,3.17 84.45,2.03 85.72,2.03 86.36,3.17 86.36,4.45 85.34,5.46
  pour Top (isolate 0.254): 85.98,53.98 86.61,53.98 86.74,53.85 86.74,46.61 86.61,46.48 86.11,46.48 84.84,47.75 84.84,52.83
  pour Bottom (isolate 0.254): 84.71,52.83 84.71,41.78 87.5,38.99 88.27,38.99 89.66,40.39 89.66,43.56 86.87,46.35 86.87,53.34 86.11,54.1 85.98,54.1
  pour Top (isolate 0.254): 80.39,36.96 80.01,36.58 80.01,35.31 80.01,35.05 80.77,34.29 83.57,34.29 89.66,40.39 89.66,40.89 89.15,41.4 88.9,41.66 85.09,41.66
  pour Top: 67.82,51.56 67.82,51.94 69.34,53.47 69.6,53.47 69.98,52.96 70.61,52.2 69.6,51.18 68.07,51.18
  pour Bottom: 67.69,56.01 67.69,51.56 67.94,51.31 68.07,51.18 69.72,51.18 70.74,52.2 70.74,52.45 69.72,53.47 69.72,56.52 69.6,56.64 69.34,56.9 68.2,56.9 67.69,56.39
  pour Bottom: 16.26,36.96 16.26,36.07 16.13,35.94 12.06,35.94 11.18,36.83 9.14,36.83 8.64,37.34
  pour Top (isolate 0.254): 85.22,51.94 86.74,53.47 86.74,55.25 84.58,57.4 83.31,57.4 81.15,59.56 73.91,59.56 72.39,58.04 72.39,52.32 72.39,51.94 73.41,50.93 74.17,50.93 75.18,51.94 75.56,52.32 75.56,58.04 76.07,58.55 80.64,58.55 82.93,56.26 84.45,54.74 84.45,52.7
  pour Bottom: 69.72,51.05 74.42,51.05 74.55,51.18 75.56,52.2 75.56,52.32 75.56,52.58 74.93,53.21 73.15,53.21 72.64,52.7 72.26,52.32 70.74,52.32 70.61,52.45 69.85,53.21 69.85,53.34 69.22,52.7 69.22,51.31 69.47,51.05
  pour Bottom (isolate 0.254): 35.56,52.07 35.56,48.89 38.1,46.35 38.1,39.37 36.83,38.1 36.83,34.92 37.47,34.29 40.64,34.29 41.27,34.92 41.27,38.1 40.01,39.37 40.01,46.35 43.18,49.53 43.18,52.07 42.55,52.7 36.2,52.7
  pour Bottom (isolate 0.254): 13.34,56.52 13.34,55.25 12.06,53.98 10.79,53.98 8.89,52.07 8.89,38.1 10.79,36.2 10.79,34.92 9.53,33.66 8.26,33.66 6.99,34.92 6.99,52.07 9.53,54.61 9.53,56.52 10.16,57.15 10.79,57.78 12.7,57.78 13.34,57.15
  pour Top (isolate 0.254): 8.89,17.14 10.16,17.14 11.43,18.41 11.43,19.05 11.43,20.32 10.79,20.95 10.16,21.59 8.26,21.59 5.08,24.77 5.08,30.48 8.26,33.66 9.53,33.66 10.79,34.92 10.79,36.83 9.53,38.1 8.26,38.1 7.62,38.1 6.35,36.83 6.35,35.56 3.17,32.38 3.17,21.59 7.62,17.14
  pour Top (isolate 0.254): 61.47,57.15 61.47,57.91 61.98,58.67 67.31,58.67 69.6,56.64 69.6,55.88 68.07,55.88 68.07,56.64 67.82,56.9 61.72,56.9
  pour Bottom: 84.07,19.56 85.34,18.29 85.34,2.03 84.07,2.03 84.07,16.76 83.06,17.78 83.06,18.54
A0  (via drill 0.35)
  Top 0.305: I2C.1 61.11,51.44 60.45,52.09 57.9,52.09 57.17,52.82 57.17,54.63 63.25,60.71 81.53,60.71 83.72,58.52 87.53,58.52 v87.88,58.17 | v87.88,56.39 87.38,55.88 JP0.2
  Bottom 0.305: v87.88,58.17 v87.88,56.39
A1  (via drill 0.35)
  Top 0.305: I2C.2 61.1,50.8 60.26,51.64 57.72,51.64 56.72,52.63 56.72,54.83 63.06,61.16 81.72,61.16 83.91,58.98 88.09,58.98 v88.9,58.17 | v88.9,56.39 88.9,55.88 89.41,55.37 89.41,52.07 88.9,51.56 87.88,51.56 87.38,51.05 JP1.2
  Bottom 0.305: v88.9,58.17 v88.9,56.39
A2  (via drill 0.35)
  Top 0.305: I2C.3 61.11,50.14 60.07,51.18 57.53,51.18 56.26,52.45 56.26,55.01 62.87,61.62 81.91,61.62 84.09,59.45 88.63,59.45 v89.92,58.17 | v89.92,56.39 89.92,55.88 90.17,55.63 90.17,49.53 89.15,48.51 87.88,48.51 87.38,48.01 JP2.2
  Bottom 0.305: v89.92,58.17 v89.92,56.39
D1
  Top 0.305: R2.P$1 12.7,29.21 13.65,30.16 Q1.2 14.75,31.26 17.78,34.29 17.78,40.01 20.32,42.55 40.64,42.55 46.35,48.26 46.35,56.52 M2.1
D2
  Top 0.305: R5.P$1 22.86,29.21 23.81,30.16 Q2.2 24.91,31.26 27.94,34.29 27.94,39.37 29.84,41.27 40.89,41.27 47.62,48.01 47.62,55.25 M2.2
D3
  Top 0.305: R8.P$1 33.02,29.21 33.97,30.16 Q3.2 35.07,31.26 38.1,34.29 38.1,38.73 39.37,40.01 41.27,40.01 48.9,47.62 48.9,53.98 M2.3
D4
  Top 0.305: R11.P$1 43.18,29.21 44.13,30.16 Q4.2 46.5,31.26 48.26,33.02 48.26,35.56 53.34,40.64 53.34,55.63 53.34,55.88 53.34,57.66 60.2,64.52 61.98,64.52 M2.4
D5  (via drill 0.35)
  Top 0.305: R14.P$1 54.61,29.21 55.56,30.16 Q5.2 57.29,31.26 v57.78,31.75
  Bottom 0.305: M2.5 55.88,55.88 55.88,34.92 57.78,33.02 v57.78,31.75
D6
  Top 0.305: R17.P$1 65.02,29.21 65.72,29.91 Q6.2
  Bottom 0.305: R17.P$1 59.69,30.48 59.69,57.78 67.94,66.04 M2.6
D7
  Top 0.305: R20.P$1 74.93,29.21 75.88,30.16 Q7.2
  Bottom 0.305: R20.P$1 66.04,34.29 66.04,54.7 65.28,55.46 65.28,58.3 71.12,64.15 M2.7
D8
  Top 0.305: R23.P$1 85.09,29.21 86.04,30.16 Q8.2
  Bottom 0.305: M2.8 67.31,59.69 67.31,38.73 67.94,38.1 78.74,38.1 80.01,36.83 80.01,30.48 R23.P$1
GND  (via drill 0.3, 0.35)
  other vias: 60.96,45.09 63.63,44.83 65.02,54.36 65.02,52.83 54.86,57.66 57.91,60.71 62.48,64.01 67.31,64.01 68.58,64.01 69.85,64.01 42.16,46.23 43.69,47.75 3.81,41.4 3.81,46.48 12.45,40.89 16.26,38.61 16.51,40.89 18.03,42.42 19.3,43.69 21.34,43.69 23.37,43.69 37.08,43.69 35.56,43.69 12.45,46.23 4.57,58.67 15.49,58.93 15.75,63.75 42.93,63.5 42.67,68.83 64.26,68.83 73.66,69.09 89.41,50.04 89.41,47.24 88.39,54.61 17.53,2.03 27.69,2.03 38.1,2.29 48.77,2.29 59.69,2.29 69.85,2.29 80.01,2.29 91.69,2.29 88.14,11.43 81.53,16.51 77.47,11.18 71.88,16.51 67.56,11.18 61.72,16.76 57.15,11.18 49.28,15.24 43.69,10.67 38.35,15.75 33.27,10.92 28.19,15.75 23.37,10.92 17.78,15.75 13.21,11.18 3.81,13.72 98.3,61.47 89.92,59.94 91.69,58.17
  pour Top (isolate 0.254): 60.83,45.72 60.83,44.83 63.75,44.83 63.75,45.72
  pour Bottom (isolate 0.406, rank 2): 0,71.12 0,0 99.69,0 99.69,71.12
  pour Top (isolate 0.254): 62.99,54.86 62.99,52.58 66.8,52.58 66.8,55.37 66.29,55.88 65.79,55.88 65.53,54.86
  pour Top (isolate 0.254): 53.85,57.66 53.85,56.13 54.36,56.13 61.47,63.25 71.37,63.25 71.63,63.5 71.63,64.26 71.37,64.52 62.99,64.52 62.48,64.52 61.98,64.01 60.2,64.01
  pour Top (isolate 0.406, rank 2): -0.25,71.12 -0.25,-0.25 100.08,-0.25 100.08,71.37 0,71.37
  pour Top (isolate 0.254): 87.88,54.36 87.88,52.32 88.9,52.32 88.9,55.12 88.65,55.37 87.88,55.37
N$1
  Top 0.305: R1.P$2 7.62,10.16 D1.A
N$2
  Top 0.305: R4.P$2 17.78,10.16 D2.A
N$3
  Top 0.305: R7.P$2 27.94,10.16 D3.A
N$4
  Top 0.305: R10.P$2 38.1,10.16 D4.A
N$5
  Top 0.305: S2.1 20.32,6.35 20.95,6.98 23.5,6.98 R4.P$1 25.4,18.06 B2.1 17.8,25.65 17.8,31.01 20.15,33.36 Q2.3 24.21,33.36 R6.P$2
N$6
  Top 0.305: R13.P$2 52.07,12.7 D5.A
N$7
  Top 0.305: R16.P$2 62.23,12.7 D6.A
N$8
  Top 0.305: R19.P$2 72.39,12.7 D7.A
N$9
  Top 0.305: R22.P$2 82.55,12.7 D8.A
N$10
  Top 0.305: R25.P$1 D9.A
N$11
  Top 0.305: S4.1 40.64,6.35 41.27,6.98 43.81,6.98 R10.P$1 45.72,18.06 B4.1 38.1,25.68 38.1,31.5 39.96,33.36 Q4.3 44.53,33.36 R12.P$2
N$12
  Top 0.305: S6.1 62.23,6.35 62.87,6.98 67.94,6.98 R16.P$1 69.85,15.52 B6.1 59.72,25.65 59.72,32.54 60.54,33.36 Q6.3 66.12,33.36 R18.P$2
N$13
  Top 0.305: S8.1 82.55,5.71 83.82,6.98 88.27,6.98 R22.P$1 90.17,15.52 B8.1 80.03,25.65 80.03,32.79 80.6,33.36 Q8.3 86.44,33.36 R24.P$2
N$14
  Top 0.305: S7.1 72.39,5.08 74.3,6.98 78.11,6.98 R19.P$1 80.01,15.52 B7.1 69.88,25.65 69.88,32.54 70.7,33.36 Q7.3 76.28,33.36 R21.P$2
N$15
  Top 0.305: S5.1 52.07,6.35 52.7,6.98 57.78,6.98 R13.P$1 59.69,15.52 B5.1 49.02,26.19 49.02,31.5 50.88,33.36 Q5.3 55.96,33.36 R15.P$2
N$16
  Top 0.305: S3.1 30.48,5.71 31.75,6.98 33.66,6.98 R7.P$1 35.56,18.06 B3.1 27.94,25.68 27.94,31.24 30.06,33.36 Q3.3 34.37,33.36 R9.P$2
N$17
  Top 0.305: S1.1 10.16,5.71 11.43,6.98 13.34,6.98 R1.P$1 15.24,18.06 B1.1 7.11,26.19 7.11,29.97 10.5,33.36 Q1.3 14.05,33.36 R3.P$2
SCL
  Top 0.305: I2C.18 71.02,50.14 R34.P$2
  Bottom 0.305: 87.01,57.8 87,57.78 | 87,57.78 81.28,52.07 76.07,52.07 74.04,50.04 R34.P$2 | 87,57.78 87,63.12 89.15,65.28 89.15,67.06 88.39,67.82 86.61,67.82 85.09,66.29 M1.3
SCL0
  Top 0.305: P0.4 94.74,18.29 94.74,32.88 90.68,36.95 90.68,41.15 89.46,42.37 82.69,42.37 80.56,40.23 58.83,40.23 56.39,42.67 56.39,46.99 57.58,48.18 I2C.6 63.42,48.18 64.9,49.66 64.9,50.83 63.81,51.92 61.27,51.92 60.64,52.55 59.21,52.55 R30.P$1
SCL1
  Top 0.305: R31.P$1 58.17,43.18 58.17,43.69 60.71,46.23 I2C.9 65.28,46.23 65.58,45.92 65.58,43.5 68.39,40.69 80.37,40.69 82.5,42.82 89.65,42.82 91.14,41.34 91.14,37.13 P1.4
SCL2
  Top 0.305: I2C.13 68.94,46.89 69.85,45.97 69.85,44.2 R32.P$1 | R32.P$1 71.88,42.93 | R32.P$1 76.98,42.93 78.25,44.2 95,44.2 P2.4
SCL3
  Top 0.305: I2C.16 69.01,48.84 71.12,47.5 R33.P$1 72.95,44.65 94.61,44.65 95.28,45.31 95.28,46.24 98.55,49.51 98.55,59.18 98.04,59.69 P3.4
SDA
  Top 0.305: I2C.19 69.85,50.8 71.12,52.07 R35.P$2 71.12,53.98
  Bottom 0.305: R35.P$2 71.12,54.61 71.75,55.25 82.55,55.25 85.09,57.78 85.09,63.5 M1.4
SDA0
  Top 0.305: P0.3 94.28,16.2 94.28,32.69 90.22,36.76 90.22,40.89 89.2,41.91 82.88,41.91 80.74,39.78 58.64,39.78 55.93,42.48 55.93,47.3 R29.P$1 58.75,49.78 59.69,48.84 I2C.5
SDA1
  Top 0.305: P1.3 98.3,30.99 98.3,32.77 94.74,36.32 94.74,40.89 92.35,43.28 82.31,43.28 80.18,41.15 68.58,41.15 66.04,43.69 66.04,46.48 65.53,46.99 62.46,46.99 I2C.8 60.73,46.89 59.82,46.1 58.8,46.1 R28.P$1
SDA2
  Top 0.305: I2C.12 67.31,46.23 66.8,45.72 66.8,44.7 R27.P$1 69.9,41.6 79.99,41.6 82.12,43.74 92.54,43.74 93.1,43.18 P2.3
SDA3
  Top 0.305: I2C.15 66.37,48.18 65.79,48.77 65.79,50.55 71.12,55.88 R26.P$1 | P3.3 87.76,57.15 86.84,58.06 83.53,58.06 81.34,60.25 72.52,60.25 71.12,58.85 R26.P$1 | 71.12,57.66 R26.P$1
VBAT
  pour Top (isolate 0.254): 50.8,67.94 51.44,67.94 52.7,66.67 52.7,64.77 45.72,57.78 35.56,57.78 33.02,55.25 33.02,45.72 33.02,45.09 31.75,43.81 25.4,43.81 24.13,45.09 24.13,51.44 24.13,52.07 25.4,53.34 27.3,55.25 31.75,55.25 35.56,59.05 45.72,59.05 49.53,62.86 49.53,67.31 50.16,67.94
VSS  (via drill 0.3, 0.35)
  other vias: 14.22,28.96 14.73,32.51 17.53,32.51 20.07,31.24 21.08,28.19 24.64,28.19 26.92,31.75 87.88,30.99 86.87,28.7 83.31,27.94 82.55,30.73 81.79,32 78.49,32.26 77.47,31.24 76.71,27.94 73.15,27.94 72.39,30.99 70.87,32 69.09,32.51 67.31,31.24 67.31,27.94 62.74,27.94 62.23,31.24 61.21,32 58.67,32.51 56.9,28.19 52.58,28.19 50.29,30.99 51.31,32 47.75,30.99 45.97,32.51 44.96,28.19 41.66,27.94 39.37,31.24 40.39,32.26 36.83,31.5 34.54,28.19 35.31,32.77 29.72,31.5 30.99,28.19 64.01,50.16 65.02,48.26 69.47,49.4 69.6,47.62 68.45,44.58 81.03,50.93 81.03,49.66 81.28,56.39
  pour Top (isolate 0.254): 10.67,32.26 10.67,28.19 11.18,27.69 90.17,27.69 90.42,27.94 90.42,31.75 89.15,33.02 11.43,33.02
  pour Bottom: 10.41,32.51 10.41,28.19 11.18,27.43 90.17,27.43 90.68,27.94 90.68,31.75 89.15,33.27 11.18,33.27
  pour Bottom (isolate 0.254): 81.79,67.06 82.8,67.56 83.82,67.56 84.58,66.8 84.58,65.28 84.07,64.77 84.07,57.91 82.04,55.88 79.88,55.88 80.26,56.13 83.06,59.44 82.8,64.26 81.79,65.53
  pour Top (isolate 0.254): 68.33,49.53 68.33,49.78 69.34,49.78 69.85,49.78 70.36,49.28 77.22,49.28 77.98,48.51 70.36,48.51 69.6,49.28 68.58,49.28
  pour Top: 62.87,49.4 63.5,48.77 64.52,49.78 64.52,50.67 63.63,51.56 63.25,51.56 63.25,49.66 62.99,49.4
  pour Top: 62.99,47.5 63.25,47.24 70.23,47.24 70.23,47.62 69.98,47.88 66.04,47.88 64.9,49.02 63.63,47.75 63.37,47.75 62.99,47.75
  pour Bottom: 63.37,50.93 66.93,50.93 66.93,47.24 63.37,47.24
  pour Bottom (isolate 0.254): 69.09,49.78 69.09,43.69 70.23,43.69 70.36,47.37 71.12,48.01 71.12,48.77 70.1,49.78
  pour Top (isolate 0.254): 68.07,45.59 69.34,45.59 69.47,45.47 69.47,43.81 68.2,43.81 67.82,44.2 67.82,45.59
  pour Bottom: 67.69,45.21 67.69,44.32 68.07,43.94 69.72,43.94 69.85,44.07 69.85,45.09 69.47,45.47 69.34,45.59 68.07,45.59
  pour Bottom: 87,29.34 88.9,27.43 90.3,27.43
  pour Bottom (isolate 0.254): 85.98,33.4 85.98,38.23 81.15,43.05 81.15,47.62 80.64,48.13 80.01,48.77 77.6,48.77 76.71,49.66 76.58,49.78 76.58,50.8 76.58,51.56 76.71,51.69 77.22,52.2 79.12,52.2 80.9,52.2 81.79,51.31 81.79,43.43 86.74,38.48 86.74,32.13 86.87,32 85.72,32 85.72,33.15
  pour Top (isolate 0.254): 76.2,49.53 76.83,50.16 76.83,53.98 78.11,55.25 79.38,55.25 80.01,55.88 80.52,56.52 81.15,57.15 81.28,57.15 81.92,56.52 81.92,48.26 76.2,48.26

### Text on the board
tNames: pam control v0.1 / J. Realmuto 2019